# EAGLE design canNode (EAGLE 4.11)
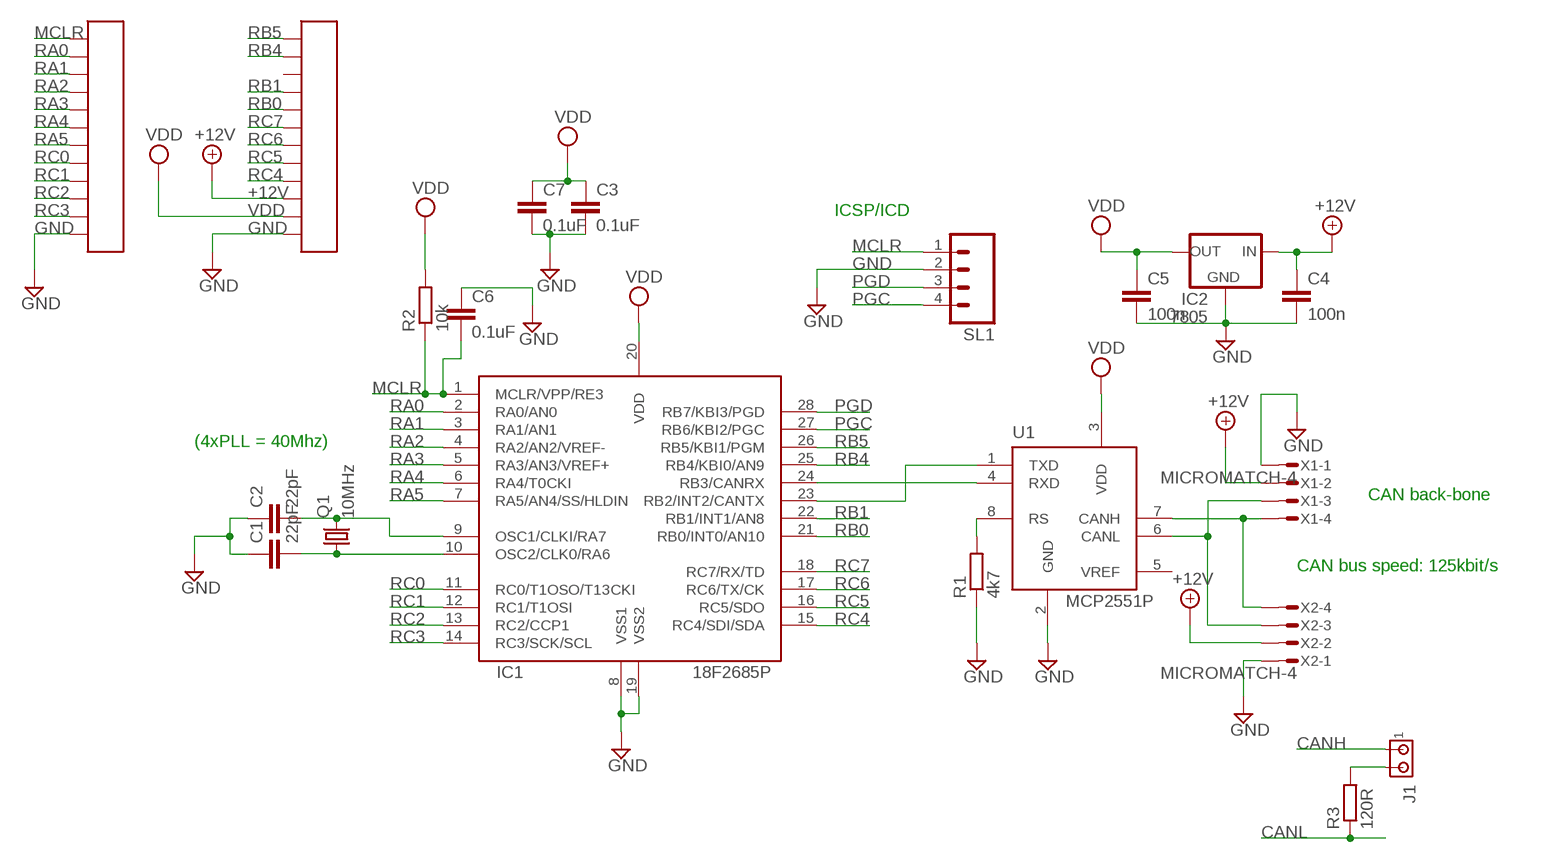
[diagram p0: schematic, sheet 1]

## Parts
C1  22pF  C-EU025-024X044  [C025-024X044]
C2  22pF  C-EU025-024X044  [C025-024X044]
C3  0.1uF  C-EU025-025X050  [C025-025X050]
C4  100n  C-EU025-025X050  [C025-025X050]
C5  100n  C-EU025-025X050  [C025-025X050]
C6  0.1uF  C-EU025-025X050  [C025-025X050]
C7  0.1uF  C-EU025-025X050  [C025-025X050]
IC1  18F2685P  [DIL28-3]
IC2  7805  78XXS  [78XXS]
J1  MTA02-100  [10X02MTA]
Q1  10MHz  CRYTALHC49S  [HC49/S]
R1  4k7  R-EU_0207/7  [0207/7]
R2  10k  R-EU_0207/7  [0207/7]
R3  120R  R-EU_0207/2V  [0207/2V]
SL1  M04  [04P]
U1  MCP2551P  [DIL8]
U$1  COLUMN12  [COLUMN12]
U$2  COLUMN12  [COLUMN12]
X1  MICROMATCH-4  [MICROMATCH-4]
X2  MICROMATCH-4  [MICROMATCH-4]

## Nets
+12V: C4.1 IC2.IN U$1.10 X1.2 X2.2
CANH: J1.1 U1.7(CANH) X1.4 X2.4
CANL: R3.1 U1.6(CANL) X1.3 X2.3
CANRX: IC1.24(RB3/CANRX) U1.4(RXD)
CANTX: IC1.23(RB2/INT2/CANTX) U1.1(TXD)
GND: C1.1 C2.1 C3.2 C4.2 C5.2 C6.1 C7.2 IC1.8(VSS1) IC1.19(VSS2) IC2.GND R1.1 SL1.2 U1.2(GND) U$1.12 U$2.12 X1.1 X2.1
MCLR: C6.2 IC1.1(MCLR/VPP/RE3) R2.1 SL1.1 U$2.1
OSC1: C2.2 IC1.9(OSC1/CLKI/RA7) Q1.2
OSC2: C1.2 IC1.10(OSC2/CLK0/RA6) Q1.1
PGC: IC1.27(RB6/KBI2/PGC) SL1.4
PGD: IC1.28(RB7/KBI3/PGD) SL1.3
PRE_J1: J1.2 R3.2
RA0: IC1.2(RA0/AN0) U$2.2
RA1: IC1.3(RA1/AN1) U$2.3
RA2: IC1.4(RA2/AN2/VREF-) U$2.4
RA3: IC1.5(RA3/AN3/VREF+) U$2.5
RA4: IC1.6(RA4/T0CKI) U$2.6
RA5: IC1.7(RA5/AN4/SS/HLDIN) U$2.7
RB0: IC1.21(RB0/INT0/AN10) U$1.5
RB1: IC1.22(RB1/INT1/AN8) U$1.4
RB4: IC1.25(RB4/KBI0/AN9) U$1.2
RB5: IC1.26(RB5/KBI1/PGM) U$1.1
RC0: IC1.11(RC0/T1OSO/T13CKI) U$2.8
RC1: IC1.12(RC1/T1OSI) U$2.9
RC2: IC1.13(RC2/CCP1) U$2.10
RC3: IC1.14(RC3/SCK/SCL) U$2.11
RC4: IC1.15(RC4/SDI/SDA) U$1.9
RC5: IC1.16(RC5/SDO) U$1.8
RC6: IC1.17(RC6/TX/CK) U$1.7
RC7: IC1.18(RC7/RX/TD) U$1.6
RS: R1.2 U1.8(RS)
VDD: C3.1 C5.1 C7.1 IC1.20(VDD) IC2.OUT R2.2 U1.3(VDD) U$1.11
Unconnected: U1.5(VREF) U$1.3

## Notes on the sheet
- ICSP/ICD
- (4xPLL = 40Mhz)
- CAN back-bone
- CAN bus speed: 125kbit/s

## Library data of the parts
C1-C7 = rcl:C-EU: CAPACITOR, European symbol
IC1 = microchip:18F268*
IC2 = v-reg:78XXS: VOLTAGE REGULATOR
J1 = con-amp:MTA02-100: AMP connector
Q1 = crystal:CRYTAL: CRYSTAL
R1-R3 = rcl:R-EU_: RESISTOR, European symbol
SL1 = con-amp-quick:M04: AMP QUICK CONNECTOR
U1 = microchip_can:MCP2551: High Speed CAN tranceiver
U$1 U$2 = expboard:COLUMN12
X1 X2 = con-amp-micromatch:MICROMATCH-4: MicroMaTch 4 7-215464-4 / 0-215464-4 Drawing Number C-215464 DDEController.pdf

## Board
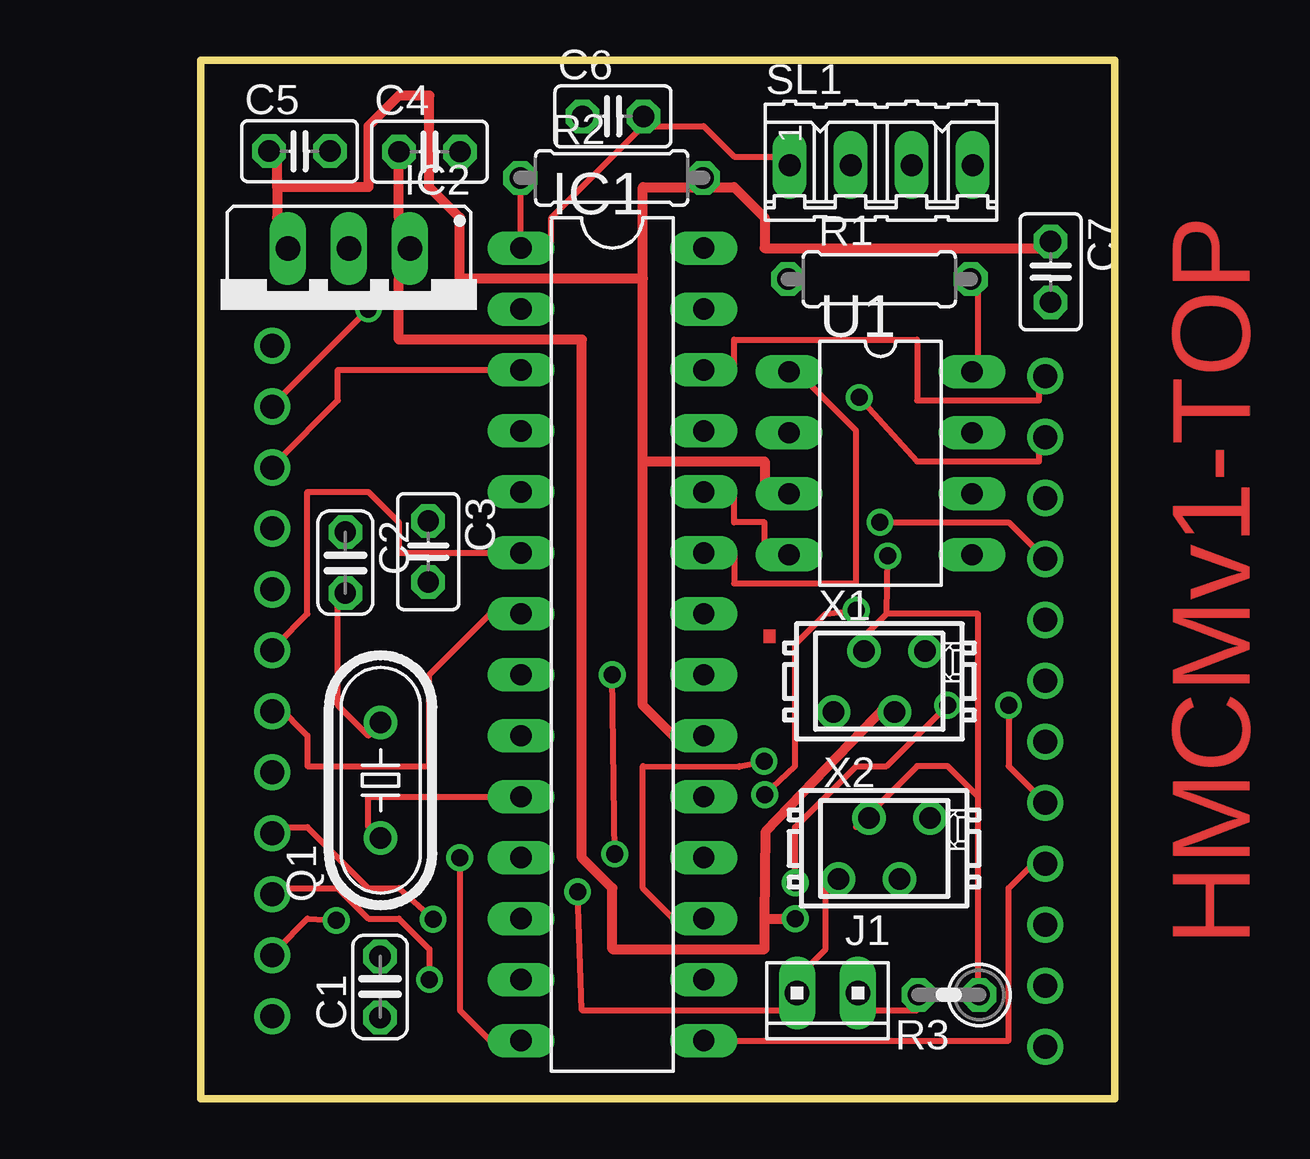
[diagram p1: board, top side]
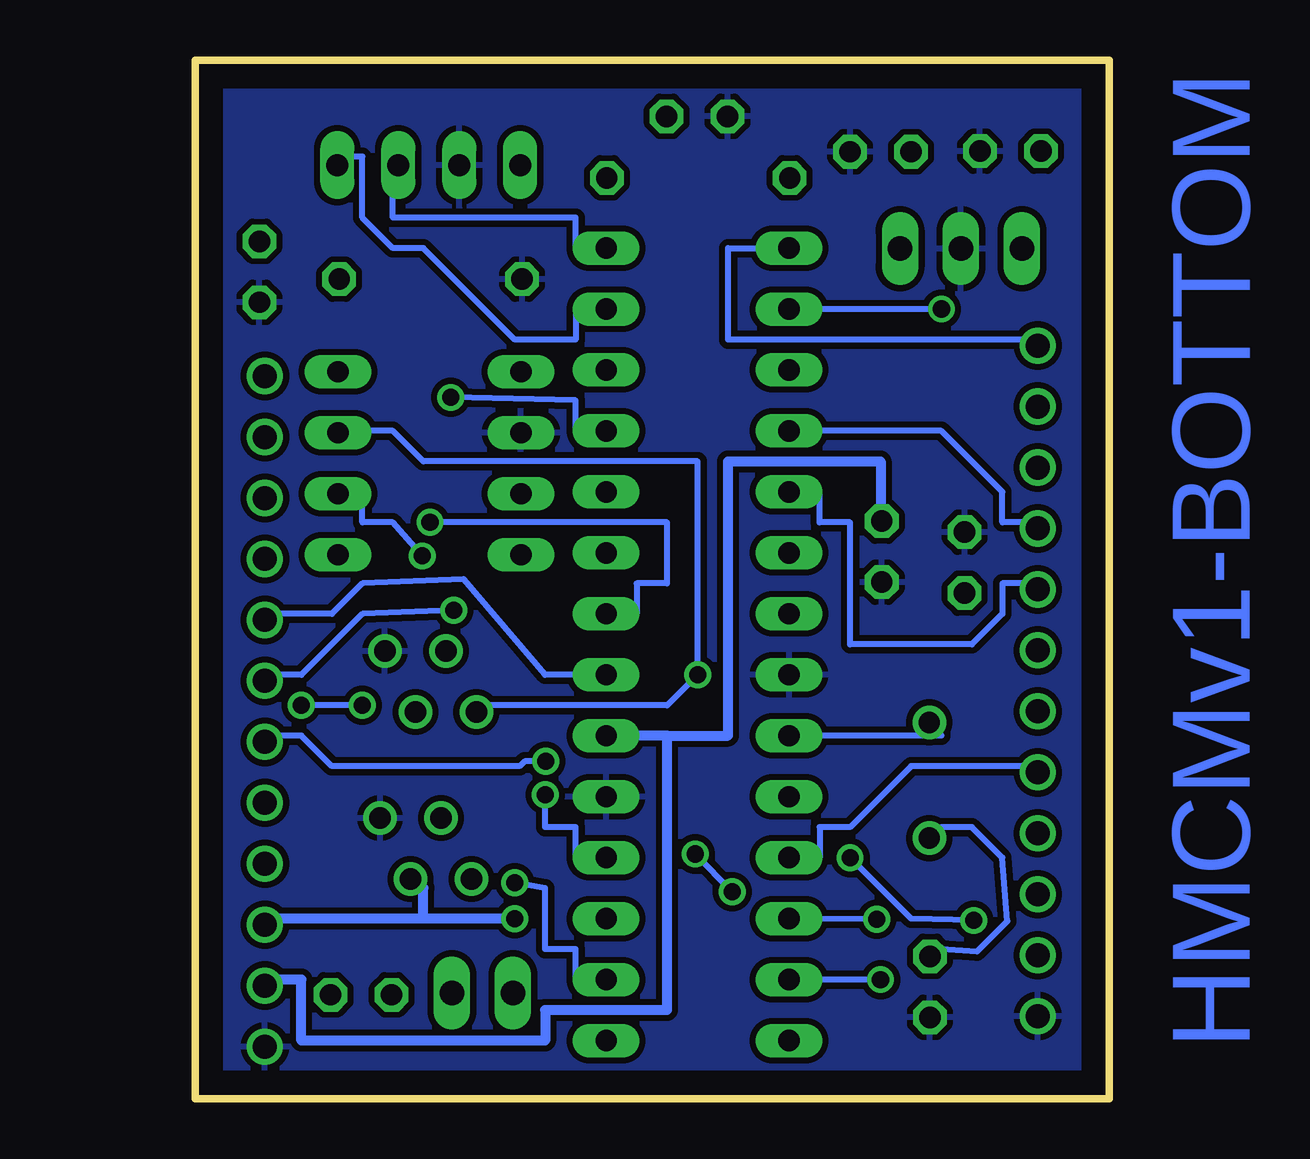
[diagram p2: board, bottom side, seen from below]

Size 38.08 x 43.28 mm. Coordinates in mm from the lower left corner, seen from the top.
Outline: 0,0 38.08,0 38.08,43.28 0,43.28 0,0
Copper layers (1*16): Top 0.035mm / dielectric 1.5mm / Bottom 0.035mm
Design rules "10mils": minimum track width 10mil, minimum drill 24mil, track to track 10mil, track to pad 10mil, pad to pad 10mil, via to via 10mil, smd to smd 10mil, copper to edge 40mil, drill to drill 10mil, minimum pad ring 10mil, minimum via ring 8mil, stop-mask expansion 0mil, vias tented up to drill 0mil, thermal gap 10mil

### Footprints (pad centres in the part's own frame; a part is rotated, then mirrored left to right if it is on the bottom)
C025-024X044 = drill 0.889 octagon: 1 -1.27,0; 2 1.27,0
C025-025X050 = drill 0.889 octagon: 1 -1.27,0; 2 1.27,0
DIL28-3 = drill 0.889 long: 1 -16.51,-3.81; 2 -13.97,-3.81; 3 -11.43,-3.81; 4 -8.89,-3.81; 5 -6.35,-3.81; 6 -3.81,-3.81; 7 -1.27,-3.81; 8 1.27,-3.81; 9 3.81,-3.81; 10 6.35,-3.81; 11 8.89,-3.81; 12 11.43,-3.81; 13 13.97,-3.81; 14 16.51,-3.81; 15 16.51,3.81; 16 13.97,3.81; 17 11.43,3.81; 18 8.89,3.81; 19 6.35,3.81; 20 3.81,3.81; 21 1.27,3.81; 22 -1.27,3.81; 23 -3.81,3.81; 24 -6.35,3.81; 25 -8.89,3.81; 26 -11.43,3.81; 27 -13.97,3.81; 28 -16.51,3.81
78XXS = drill 1.016 long: GND 0,-2.54; IN -2.54,-2.54; OUT 2.54,-2.54
10X02MTA = drill 1.016 long: 1 1.27,0; 2 -1.27,0
HC49/S = drill 0.889 round: 1 -2.413,0; 2 2.413,0
0207/7 = drill 0.889 octagon: 1 -3.81,0; 2 3.81,0
0207/2V = drill 0.889 octagon: 1 -1.27,0; 2 1.27,0
04P = drill 0.914 long: 1 -3.81,0; 2 -1.27,0; 3 1.27,0; 4 3.81,0
DIL8 = drill 0.889 long: 1 -3.81,-3.81; 2 -1.27,-3.81; 3 1.27,-3.81; 4 3.81,-3.81; 5 3.81,3.81; 6 1.27,3.81; 7 -1.27,3.81; 8 -3.81,3.81
COLUMN12 = drill 1 round: 1 0,15.24; 2 0,12.7; 3 0,10.16; 4 0,7.62; 5 0,5.08; 6 0,2.54; 7 0,0; 8 0,-2.54; 9 0,-5.08; 10 0,-7.62; 11 0,-10.16; 12 0,-12.7
MICROMATCH-4 = drill 0.889 round: 1 1.905,1.27; 2 0.635,-1.27; 3 -0.635,1.27; 4 -1.905,-1.27

### Placement (x,y rotation side)
C1  7.46,4.66 90 top
C2  6.01,22.34 270 top
C3  9.47,22.8 270 top
C4  9.52,39.46 0 top
C5  4.11,39.48 0 top
C6  17.17,40.93 0 top
C7  35.4,34.46 270 top
IC1  17.14,18.94 270 top
IC2  6.17,32.88 180 top
J1  26.11,4.41 180 top
Q1  7.49,13.27 90 top
R1  28.27,34.15 0 top
R2  17.11,38.37 0 top
R3  31.16,4.33 180 top
SL1  28.34,38.9 0 top
U1  28.32,26.48 270 top
U$1  35.17,14.87 0 top
U$2  2.97,16.14 0 top
X1  28.27,17.39 0 top
X2  28.47,10.43 0 top

### Tracks (layer width: path | path; a pad name or v marks a point on that pad's centre or on a via)
+12V  (via drill 0.71)
  Top 0.406: C4.1 8.25,36.72 IC2.IN 8.25,34.18 8.25,31.64 15.87,31.64 15.87,10.05 17.14,8.78 17.14,6.24 23.49,6.24 23.49,7.51 | 23.49,7.51 23.54,11.14 28.57,16.4 X1.2 | 23.49,7.51 v24.76,7.51
  Bottom 0.406: 28.57,7.51 28.57,8.78 X2.2 | 28.57,7.51 34.92,7.51 U$1.10 | v24.76,7.51 28.57,7.51
CANH  (via drill 0.71)
  Top 0.254: X2.4 26.03,8.78 26.03,6.24 24.76,4.97 J1.1 24.76,3.7 15.87,3.7 v15.69,8.62 | v17.24,10.2 v17.14,17.67
  Bottom 0.254: X1.4 26.03,16.4 18.41,16.4 v17.14,17.67 17.14,26.56 28.57,26.56 29.84,27.83 31.11,27.83 U1.7 | v15.69,8.62 v17.24,10.2
CANL  (via drill 0.71)
  Top 0.254: 32.38,12.59 32.38,4.97 R3.1 | 32.38,12.59 31.11,13.86 29.84,13.86 27.3,11.32 X2.3 | 28.57,20.21 27.3,18.94 X1.3 | 28.57,20.21 32.38,20.21 32.38,12.59 | 28.57,20.21 v28.62,22.62
  Bottom 0.254: v28.62,22.62 29.84,24.02 31.11,24.02 31.11,25.29 U1.6
CANRX
  Top 0.254: U1.4 23.49,22.75 23.49,24.02 22.22,24.02 22.22,25.29 IC1.24
CANTX
  Top 0.254: IC1.23 22.22,22.75 22.22,21.48 27.3,21.48 27.3,27.83 24.76,30.37 U1.1
GND
  pour Bottom (isolate 0.254): 0.05,43.24 0.05,0.06 38.02,0.06 38.02,0.09 37.99,0.09 37.99,43.17
MCLR
  Top 0.254: R2.1 13.33,37.99 IC1.1 14.6,35.45 14.6,36.72 18.41,40.53 | 18.41,40.53 20.95,40.53 22.22,39.26 24.76,39.26 SL1.1 | 18.41,40.53 C6.2
  Bottom 0.254: U$2.1 3.17,31.64 15.87,31.64 15.87,35.45 IC1.1
OSC1
  Top 0.254: Q1.2 6.98,15.13 5.71,16.4 5.71,21.48 C2.2
  Bottom 0.254: IC1.9 6.98,15.13 Q1.2
OSC2
  Top 0.254: IC1.10 6.98,12.59 6.98,11.32 Q1.1
  Bottom 0.254: C1.2 6.98,6.24 5.51,6.13 4.24,7.4 4.44,10.05 5.71,11.32 6.98,11.32 Q1.1
PGC
  Bottom 0.254: IC1.27 22.22,32.91 22.22,31.64 24.76,31.64 28.57,35.45 29.84,35.45 31.11,36.72 31.11,39.26 32.38,39.26 SL1.4
PGD
  Bottom 0.254: IC1.28 22.22,35.45 22.22,36.72 29.84,36.72 29.84,37.99 SL1.3
PRE_J1
  Top 0.254: R3.2 29.84,3.7 27.3,3.7 J1.2
RA0  (via drill 0.71)
  Top 0.254: v6.98,32.91 3.17,29.1 U$2.2
  Bottom 0.254: v6.98,32.91 IC1.2
RA1
  Top 0.254: IC1.3 5.71,30.37 5.71,29.1 3.17,26.56 U$2.3
RA2
  Bottom 0.254: IC1.4 6.98,27.83 4.44,25.29 4.44,24.02 3.17,24.02 U$2.4
RA3
  Bottom 0.254: IC1.5 12.06,25.29 12.06,24.02 10.79,24.02 10.79,18.94 5.71,18.94 4.44,20.21 4.44,21.48 3.17,21.48 U$2.5
RA4
  Top 0.254: IC1.6 8.25,22.75 8.25,24.02 6.98,25.29 4.44,25.29 4.44,20.21 3.17,18.94 U$2.6
RA5
  Top 0.254: IC1.7 12.06,20.21 9.52,17.67 9.52,13.86 4.44,13.86 4.44,15.13 3.17,16.4 U$2.7
RB0
  Bottom 0.254: IC1.21 23.49,17.67 26.89,21.65 31.11,21.48 32.38,20.21 34.92,20.21 U$1.5
RB1  (via drill 0.71)
  Top 0.254: v28.29,24.02 33.65,24.02 U$1.4
  Bottom 0.254: v28.29,24.02 18.41,24.02 18.41,21.48 19.68,21.48 19.68,20.21 IC1.22
RB4  (via drill 0.71)
  Top 0.254: v27.43,29.22 29.84,26.56 34.92,26.56 34.92,27.83 U$1.2
  Bottom 0.254: v27.43,29.22 22.22,29.1 22.22,27.83 IC1.25
RB5
  Top 0.254: IC1.26 22.22,30.37 22.22,31.64 29.84,31.64 29.84,29.1 34.92,29.1 34.92,30.37 U$1.1
RC0
  Bottom 0.254: IC1.11 12.06,10.05 12.06,11.32 10.79,11.32 8.25,13.86 3.17,13.86 U$2.8
RC1  (via drill 0.71)
  Top 0.254: v9.67,7.48 8.25,8.78 6.98,8.78 4.44,11.32 3.17,11.32 U$2.9
  Bottom 0.254: v9.67,7.48 IC1.12
RC2  (via drill 0.71)
  Top 0.254: v9.52,4.97 9.52,6.24 8.25,7.51 6.98,7.51 5.71,8.78 3.17,8.78 U$2.10
  Bottom 0.254: v9.52,4.97 IC1.13
RC3  (via drill 0.71)
  Top 0.254: v10.79,10.05 10.79,3.7 12.06,2.43 IC1.14 | v5.63,7.43 4.44,7.51 3.17,6.24 U$2.11
  Bottom 0.254: v10.79,10.05 8.25,7.51 v5.63,7.43
RC4
  Top 0.254: IC1.15 33.65,2.43 33.65,8.78 34.92,10.05 U$1.9
RC5  (via drill 0.71)
  Top 0.254: v24.76,9 24.76,11.32 27.3,13.86 28.57,13.86 v31.11,16.4 | v33.65,16.4 33.65,13.86 U$1.8
  Bottom 0.254: v24.76,9 23.49,8.78 23.49,6.24 22.22,6.24 22.22,4.97 IC1.16 | v31.11,16.4 v33.65,16.4
RC6  (via drill 0.71)
  Top 0.254: v23.47,14.06 22.45,13.86 22.42,13.83 18.41,13.86 18.41,8.78 19.68,7.51 IC1.17
  Bottom 0.254: v23.47,14.06 24.35,14.06 24.56,13.86 32.38,13.86 33.65,15.13 34.92,15.13 U$1.7
RC7  (via drill 0.71)
  Top 0.254: v23.49,12.66 24.76,13.86 24.76,18.94 26.03,20.21 v27.3,20.36
  Bottom 0.254: v23.49,12.66 23.49,11.32 22.22,11.32 22.22,10.05 IC1.18 | v27.3,20.36 31.11,20.21 33.65,17.67 34.92,17.67 U$1.6
RS
  Top 0.254: R1.2 32.38,34.18 32.38,30.37 U1.8
VDD
  Top 0.406: 3.17,37.99 3.17,36.72 IC2.OUT | 3.17,37.99 3.17,39.26 C5.1 | 18.41,26.56 23.49,26.56 23.49,25.29 U1.3 | 18.41,26.56 18.41,16.4 19.68,15.13 IC1.20 | 20.95,37.99 18.41,37.99 18.41,34.18 | 18.41,26.56 18.41,34.18 | 20.95,37.99 22.22,37.99 23.49,36.72 23.49,35.45 34.92,35.45 C7.1 | 20.95,37.99 R2.2 | 3.17,37.99 6.98,37.99 6.98,40.53 8.25,41.8 9.52,41.8 9.52,37.99 10.79,36.72 10.79,34.18 18.41,34.18
  Bottom 0.254: 9.52,24.02 C3.1
  Bottom 0.406: 9.52,24.02 9.52,26.56 15.87,26.56 15.87,15.13 18.41,15.13 | 18.41,15.13 IC1.20 | 18.41,15.13 18.41,3.7 23.49,3.7 23.49,2.43 33.65,2.43 33.65,4.97 34.92,4.97 U$1.11

### Text on the board
Top: . | HMCMv1-TOP
Bottom: HMCMv1-BOTTOM